# EAGLE design relay-set-d-large-block (EAGLE 7.3.0)
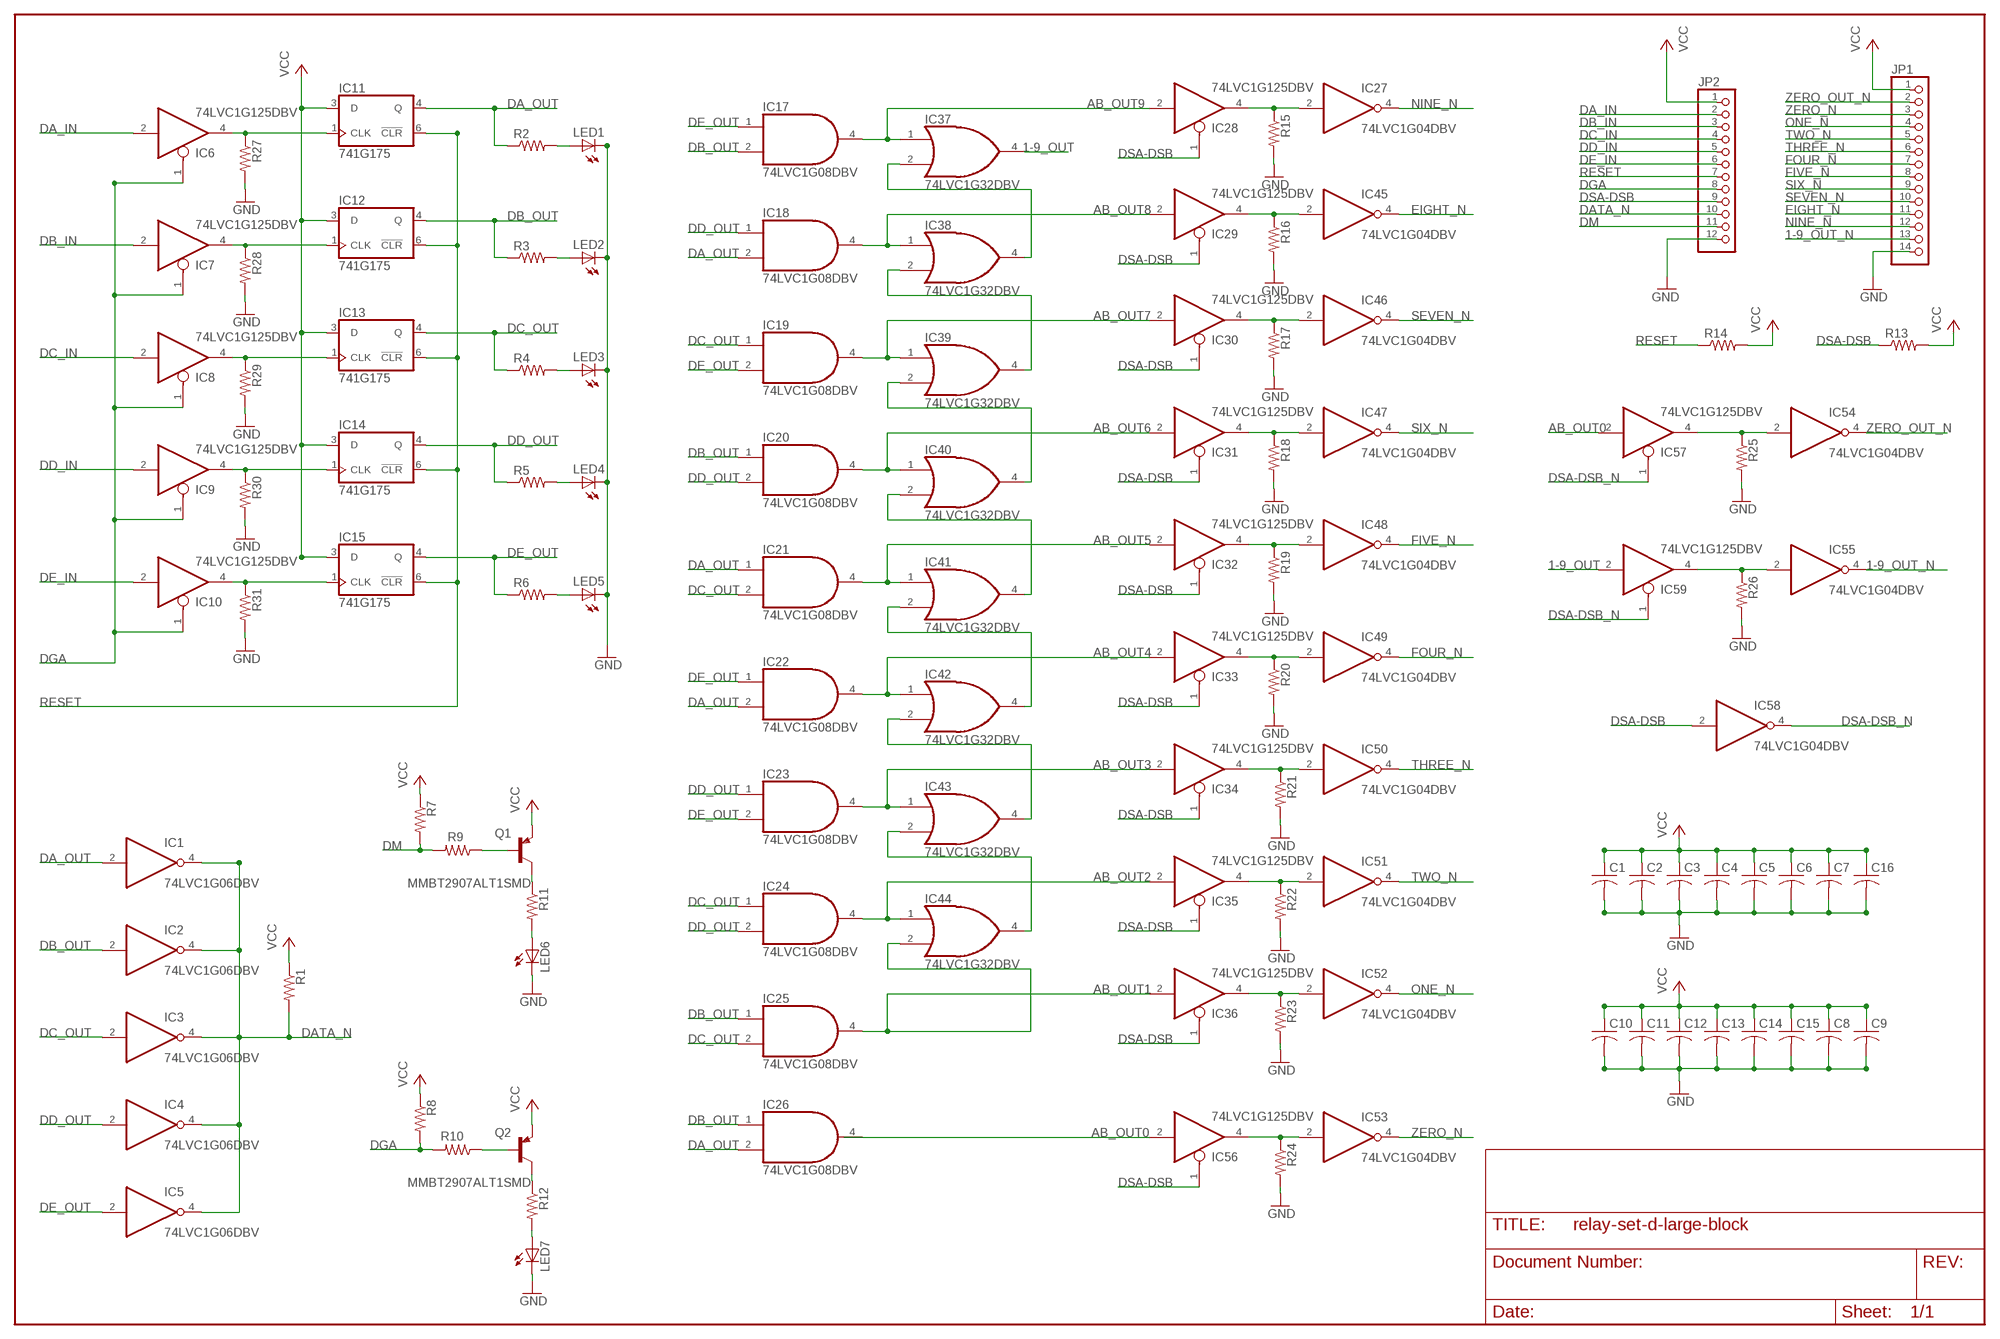
[diagram p0: schematic, sheet 1]

## Parts
C1  C-USC0805  [C0805]
C2  C-USC0805  [C0805]
C3  C-USC0805  [C0805]
C4  C-USC0805  [C0805]
C5  C-USC0805  [C0805]
C6  C-USC0805  [C0805]
C7  C-USC0805  [C0805]
C8  C-USC0805  [C0805]
C9  C-USC0805  [C0805]
C10  C-USC0805  [C0805]
C11  C-USC0805  [C0805]
C12  C-USC0805  [C0805]
C13  C-USC0805  [C0805]
C14  C-USC0805  [C0805]
C15  C-USC0805  [C0805]
C16  C-USC0805  [C0805]
IC1  74LVC1G06DBV  74AUC1G06DBV  [SOT23-5]
IC2  74LVC1G06DBV  74AUC1G06DBV  [SOT23-5]
IC3  74LVC1G06DBV  74AUC1G06DBV  [SOT23-5]
IC4  74LVC1G06DBV  74AUC1G06DBV  [SOT23-5]
IC5  74LVC1G06DBV  74AUC1G06DBV  [SOT23-5]
IC6  74LVC1G125DBV  [SOT23-5]
IC7  74LVC1G125DBV  [SOT23-5]
IC8  74LVC1G125DBV  [SOT23-5]
IC9  74LVC1G125DBV  [SOT23-5]
IC10  74LVC1G125DBV  [SOT23-5]
IC11  741G175  [DBV_R-PDSO-G6]
IC12  741G175  [DBV_R-PDSO-G6]
IC13  741G175  [DBV_R-PDSO-G6]
IC14  741G175  [DBV_R-PDSO-G6]
IC15  741G175  [DBV_R-PDSO-G6]
IC17  74LVC1G08DBV  [SOT23-5]
IC18  74LVC1G08DBV  [SOT23-5]
IC19  74LVC1G08DBV  [SOT23-5]
IC20  74LVC1G08DBV  [SOT23-5]
IC21  74LVC1G08DBV  [SOT23-5]
IC22  74LVC1G08DBV  [SOT23-5]
IC23  74LVC1G08DBV  [SOT23-5]
IC24  74LVC1G08DBV  [SOT23-5]
IC25  74LVC1G08DBV  [SOT23-5]
IC26  74LVC1G08DBV  [SOT23-5]
IC27  74LVC1G04DBV  [SOT23-5]
IC28  74LVC1G125DBV  [SOT23-5]
IC29  74LVC1G125DBV  [SOT23-5]
IC30  74LVC1G125DBV  [SOT23-5]
IC31  74LVC1G125DBV  [SOT23-5]
IC32  74LVC1G125DBV  [SOT23-5]
IC33  74LVC1G125DBV  [SOT23-5]
IC34  74LVC1G125DBV  [SOT23-5]
IC35  74LVC1G125DBV  [SOT23-5]
IC36  74LVC1G125DBV  [SOT23-5]
IC37  74LVC1G32DBV  74AHC1G32DBV  [SOT23-5]
IC38  74LVC1G32DBV  74AHC1G32DBV  [SOT23-5]
IC39  74LVC1G32DBV  74AHC1G32DBV  [SOT23-5]
IC40  74LVC1G32DBV  74AHC1G32DBV  [SOT23-5]
IC41  74LVC1G32DBV  74AHC1G32DBV  [SOT23-5]
IC42  74LVC1G32DBV  74AHC1G32DBV  [SOT23-5]
IC43  74LVC1G32DBV  74AHC1G32DBV  [SOT23-5]
IC44  74LVC1G32DBV  74AHC1G32DBV  [SOT23-5]
IC45  74LVC1G04DBV  [SOT23-5]
IC46  74LVC1G04DBV  [SOT23-5]
IC47  74LVC1G04DBV  [SOT23-5]
IC48  74LVC1G04DBV  [SOT23-5]
IC49  74LVC1G04DBV  [SOT23-5]
IC50  74LVC1G04DBV  [SOT23-5]
IC51  74LVC1G04DBV  [SOT23-5]
IC52  74LVC1G04DBV  [SOT23-5]
IC53  74LVC1G04DBV  [SOT23-5]
IC54  74LVC1G04DBV  [SOT23-5]
IC55  74LVC1G04DBV  [SOT23-5]
IC56  74LVC1G125DBV  [SOT23-5]
IC57  74LVC1G125DBV  [SOT23-5]
IC58  74LVC1G04DBV  [SOT23-5]
IC59  74LVC1G125DBV  [SOT23-5]
JP1  PINHD-1X14  [1X14]
JP2  PINHD-1X12  [1X12]
LED1  LEDCHIP-LED0805  [CHIP-LED0805]
LED2  LEDCHIP-LED0805  [CHIP-LED0805]
LED3  LEDCHIP-LED0805  [CHIP-LED0805]
LED4  LEDCHIP-LED0805  [CHIP-LED0805]
LED5  LEDCHIP-LED0805  [CHIP-LED0805]
LED6  LEDCHIP-LED0805  [CHIP-LED0805]
LED7  LEDCHIP-LED0805  [CHIP-LED0805]
Q1  MMBT2907ALT1SMD  [SOT23-BEC]
Q2  MMBT2907ALT1SMD  [SOT23-BEC]
R1  R-US_R0805  [R0805]
R2  R-US_R0805  [R0805]
R3  R-US_R0805  [R0805]
R4  R-US_R0805  [R0805]
R5  R-US_R0805  [R0805]
R6  R-US_R0805  [R0805]
R7  R-US_R0805  [R0805]
R8  R-US_R0805  [R0805]
R9  R-US_R0805  [R0805]
R10  R-US_R0805  [R0805]
R11  R-US_R0805  [R0805]
R12  R-US_R0805  [R0805]
R13  R-US_R0805  [R0805]
R14  R-US_R0805  [R0805]
R15  R-US_R0805  [R0805]
R16  R-US_R0805  [R0805]
R17  R-US_R0805  [R0805]
R18  R-US_R0805  [R0805]
R19  R-US_R0805  [R0805]
R20  R-US_R0805  [R0805]
R21  R-US_R0805  [R0805]
R22  R-US_R0805  [R0805]
R23  R-US_R0805  [R0805]
R24  R-US_R0805  [R0805]
R25  R-US_R0805  [R0805]
R26  R-US_R0805  [R0805]
R27  R-US_R0805  [R0805]
R28  R-US_R0805  [R0805]
R29  R-US_R0805  [R0805]
R30  R-US_R0805  [R0805]
R31  R-US_R0805  [R0805]

## Nets
1-9_OUT: IC37.4(O) IC59.2(I)
1-9_OUT_N: IC55.4(O) JP1.13
AB_OUT: IC26.4(O)
AB_OUT0: IC56.2(I) IC57.2(I)
AB_OUT1: IC25.4(O) IC36.2(I) IC44.2(I1)
AB_OUT2: IC24.4(O) IC35.2(I) IC44.1(I0)
AB_OUT3: IC23.4(O) IC34.2(I) IC43.1(I0)
AB_OUT4: IC22.4(O) IC33.2(I) IC42.1(I0)
AB_OUT5: IC21.4(O) IC32.2(I) IC41.1(I0)
AB_OUT6: IC20.4(O) IC31.2(I) IC40.1(I0)
AB_OUT7: IC19.4(O) IC30.2(I) IC39.1(I0)
AB_OUT8: IC18.4(O) IC29.2(I) IC38.1(I0)
AB_OUT9: IC17.4(O) IC28.2(I) IC37.1(I0)
DA: IC6.4(O) IC11.1(CLK) R27.1
DA_IN: IC6.2(I) JP2.2
DA_OUT: IC1.2(I) IC11.4(Q) IC18.2(I1) IC21.1(I0) IC22.2(I1) IC26.2(I1) R2.1
DATA_N: IC1.4(O) IC2.4(O) IC3.4(O) IC4.4(O) IC5.4(O) JP2.10 R1.2
DB: IC7.4(O) IC12.1(CLK) R28.1
DB_IN: IC7.2(I) JP2.3
DB_OUT: IC2.2(I) IC12.4(Q) IC17.2(I1) IC20.1(I0) IC25.1(I0) IC26.1(I0) R3.1
DC: IC8.4(O) IC13.1(CLK) R29.1
DC_IN: IC8.2(I) JP2.4
DC_OUT: IC3.2(I) IC13.4(Q) IC19.1(I0) IC21.2(I1) IC24.1(I0) IC25.2(I1) R4.1
DD: IC9.4(O) IC14.1(CLK) R30.1
DD_IN: IC9.2(I) JP2.5
DD_OUT: IC4.2(I) IC14.4(Q) IC18.1(I0) IC20.2(I1) IC23.1(I0) IC24.2(I1) R5.1
DE: IC10.4(O) IC15.1(CLK) R31.1
DE_IN: IC10.2(I) JP2.6
DE_OUT: IC5.2(I) IC15.4(Q) IC17.1(I0) IC19.2(I1) IC22.1(I0) IC23.2(I1) R6.1
DGA: IC6.1(OE) IC7.1(OE) IC8.1(OE) IC9.1(OE) IC10.1(OE) JP2.8 R8.2 R10.2
DM: JP2.11 R7.2 R9.2
DSA-DSB: IC28.1(OE) IC29.1(OE) IC30.1(OE) IC31.1(OE) IC32.1(OE) IC33.1(OE) IC34.1(OE) IC35.1(OE) IC36.1(OE) IC56.1(OE) IC58.2(I) JP2.9 R13.1
DSA-DSB_N: IC57.1(OE) IC58.4(O) IC59.1(OE)
EIGHT: IC29.4(O) IC45.2(I) R16.1
EIGHT_N: IC45.4(O) JP1.11
FIVE: IC32.4(O) IC48.2(I) R19.1
FIVE_N: IC48.4(O) JP1.8
FOUR: IC33.4(O) IC49.2(I) R20.1
FOUR_N: IC49.4(O) JP1.7
GND: C1.2 C2.2 C3.2 C4.2 C5.2 C6.2 C7.2 C8.2 C9.2 C10.2 C11.2 C12.2 C13.2 C14.2 C15.2 C16.2 JP1.14 JP2.12 LED1.C LED2.C LED3.C LED4.C LED5.C LED6.C LED7.C R15.2 R16.2 R17.2 R18.2 R19.2 R20.2 R21.2 R22.2 R23.2 R24.2 R25.2 R26.2 R27.2 R28.2 R29.2 R30.2 R31.2
N$11: IC40.2(I1) IC41.4(O)
N$12: IC41.2(I1) IC42.4(O)
N$13: IC42.2(I1) IC43.4(O)
N$14: IC43.2(I1) IC44.4(O)
N$16: Q2.B R10.1
N$17: IC37.2(I1) IC38.4(O)
N$18: IC38.2(I1) IC39.4(O)
N$19: IC39.2(I1) IC40.4(O)
N$20: LED1.A R2.2
N$21: LED2.A R3.2
N$22: LED3.A R4.2
N$23: Q2.C R12.1
N$24: LED7.A R12.2
N$25: Q1.B R9.1
N$26: Q1.C R11.1
N$27: LED6.A R11.2
N$28: LED4.A R5.2
N$29: LED5.A R6.2
NINE: IC27.2(I) IC28.4(O) R15.1
NINE_N: IC27.4(O) JP1.12
ONE: IC36.4(O) IC52.2(I) R23.1
ONE_N: IC52.4(O) JP1.4
OUT0: IC54.2(I) IC57.4(O) R25.1
OUT1-9: IC55.2(I) IC59.4(O) R26.1
RESET: IC11.6(!CLR) IC12.6(!CLR) IC13.6(!CLR) IC14.6(!CLR) IC15.6(!CLR) JP2.7 R14.1
SEVEN: IC30.4(O) IC46.2(I) R17.1
SEVEN_N: IC46.4(O) JP1.10
SIX: IC31.4(O) IC47.2(I) R18.1
SIX_N: IC47.4(O) JP1.9
THREE: IC34.4(O) IC50.2(I) R21.1
THREE_N: IC50.4(O) JP1.6
TWO: IC35.4(O) IC51.2(I) R22.1
TWO_N: IC51.4(O) JP1.5
VCC: C1.1 C2.1 C3.1 C4.1 C5.1 C6.1 C7.1 C8.1 C9.1 C10.1 C11.1 C12.1 C13.1 C14.1 C15.1 C16.1 IC11.3(D) IC12.3(D) IC13.3(D) IC14.3(D) IC15.3(D) JP1.1 JP2.1 Q1.E Q2.E R1.1 R7.1 R8.1 R13.2 R14.2
ZERO: IC53.2(I) IC56.4(O) R24.1
ZERO_N: IC53.4(O) JP1.3
ZERO_OUT_N: IC54.4(O) JP1.2

## Power pins joined to a net without a drawn wire
GND: IC1.3(GND) IC2.3(GND) IC3.3(GND) IC4.3(GND) IC5.3(GND) IC6.3(GND) IC7.3(GND) IC8.3(GND) IC9.3(GND) IC10.3(GND) IC11.2(GND) IC12.2(GND) IC13.2(GND) IC14.2(GND) IC15.2(GND) IC17.3(GND) IC18.3(GND) IC19.3(GND) IC20.3(GND) IC21.3(GND) IC22.3(GND) IC23.3(GND) IC24.3(GND) IC25.3(GND) IC26.3(GND) IC27.3(GND) IC28.3(GND) IC29.3(GND) IC30.3(GND) IC31.3(GND) IC32.3(GND) IC33.3(GND) IC34.3(GND) IC35.3(GND) IC36.3(GND) IC37.3(GND) IC38.3(GND) IC39.3(GND) IC40.3(GND) IC41.3(GND) IC42.3(GND) IC43.3(GND) IC44.3(GND) IC45.3(GND) IC46.3(GND) IC47.3(GND) IC48.3(GND) IC49.3(GND) IC50.3(GND) IC51.3(GND) IC52.3(GND) IC53.3(GND) IC54.3(GND) IC55.3(GND) IC56.3(GND) IC57.3(GND) IC58.3(GND) IC59.3(GND)
VCC: IC1.5(VCC) IC2.5(VCC) IC3.5(VCC) IC4.5(VCC) IC5.5(VCC) IC6.5(VCC) IC7.5(VCC) IC8.5(VCC) IC9.5(VCC) IC10.5(VCC) IC11.5(VCC) IC12.5(VCC) IC13.5(VCC) IC14.5(VCC) IC15.5(VCC) IC17.5(VCC) IC18.5(VCC) IC19.5(VCC) IC20.5(VCC) IC21.5(VCC) IC22.5(VCC) IC23.5(VCC) IC24.5(VCC) IC25.5(VCC) IC26.5(VCC) IC27.5(VCC) IC28.5(VCC) IC29.5(VCC) IC30.5(VCC) IC31.5(VCC) IC32.5(VCC) IC33.5(VCC) IC34.5(VCC) IC35.5(VCC) IC36.5(VCC) IC37.5(VCC) IC38.5(VCC) IC39.5(VCC) IC40.5(VCC) IC41.5(VCC) IC42.5(VCC) IC43.5(VCC) IC44.5(VCC) IC45.5(VCC) IC46.5(VCC) IC47.5(VCC) IC48.5(VCC) IC49.5(VCC) IC50.5(VCC) IC51.5(VCC) IC52.5(VCC) IC53.5(VCC) IC54.5(VCC) IC55.5(VCC) IC56.5(VCC) IC57.5(VCC) IC58.5(VCC) IC59.5(VCC)

## Library data of the parts
C1-C16 = resistor:C-US: CAPACITOR, American symbol
IC1-IC5 = 74xx-little-us:74*1G06: Single Inverter Buffer/Driver With Open-Drain Output
IC6-IC10 IC28-IC36 IC56 IC57 IC59 = 74xx-little-us:74*1G125: Single Bus Buffer Gate with 3-State Output
IC11-IC15 = 74xx-little-us:74*1G175
IC17-IC26 = 74xx-little-us:74*1G08: 2-input AND gate
IC27 IC45-IC55 IC58 = 74xx-little-us:74*1G04: INVERTER Gate
IC37-IC44 = 74xx-little-us:74*1G32: 2-input OR gate
JP1 = pinhead:PINHD-1X14: PIN HEADER
JP2 = pinhead:PINHD-1X12: PIN HEADER
LED1-LED7 = led:LED: LED OSRAM: - CHIPLED LG R971, LG N971, LY N971, LG Q971, LY Q971, LO R971, LY R971 LH N974, LH R974 LS Q976, LO Q976, LY Q976 LO Q996 - Hyper CHIPLED LW Q18S LB Q993, LB Q99A, LB R99A - SideLED LS A670, LO A670, LY A670, LG A670, LP A670 LB A673, LV A673, LT A673, LW A673 LH A674 LY A675 LS A676, LA A676, LO A676, LY A676, LW A676 LS A679, LY A679, LG A679 - Hyper Micro SIDELED® LS Y876, LA Y876, LO Y876, LY Y876 LT Y87S - SmartLED LW L88C, LW L88S LB L89C, LB L89S, LG L890 LS L89K, LO L89K, LY L89K LS L896, LA L896, LO L896, LY L896 - TOPLED LS T670, LO T670, LY T670, LG T670, LP T670 LSG T670, LSP T670, LSY T670, LOP T670, LYG T670 LG T671, LOG T671, LSG T671 LB T673, LV T673, LT T673, LW T673 LH T674 LS T676, LA T676, LO T676, LY T676, LB T676, LH T676, LSB T676, LW T676 LB T67C, LV T67C, LT T67C, LS T67K, LO T67K, LY T67K, LW E67C LS E67B, LA E67B, LO E67B, LY E67B, LB E67C, LV E67C, LT E67C LW T67C LS T679, LY T679, LG T679 LS T770, LO T770, LY T770, LG T770, LP T770 LB T773, LV T773, LT T773, LW T773 LH T774 LS E675, LA E675, LY E675, LS T675 LS T776, LA T776, LO T776, LY T776, LB T776 LHGB T686 LT T68C, LB T68C - Hyper Mini TOPLED® LB M676 - Mini TOPLED Santana® LG M470 LS M47K, LO M47K, LY M47K Source: http://www.osram.convergy.de LUXEON: - LUMILED® LXK2-PW12-R00, LXK2-PW12-S00, LXK2-PW14-U00, LXK2-PW14-V00 LXK2-PM12-R00, LXK2-PM12-S00, LXK2-PM14-U00 LXK2-PE12-Q00, LXK2-PE12-R00, LXK2-PE12-S00, LXK2-PE14-T00, LXK2-PE14-U00 LXK2-PB12-K00, LXK2-PB12-L00, LXK2-PB12-M00, LXK2-PB14-N00, LXK2-PB14-P00, LXK2-PB14-Q00 LXK2-PR12-L00, LXK2-PR12-M00, LXK2-PR14-Q00, LXK2-PR14-R00 LXK2-PD12-Q00, LXK2-PD12-R00, LXK2-PD12-S00 LXK2-PH12-R00, LXK2-PH12-S00 LXK2-PL12-P00, LXK2-PL12-Q00, LXK2-PL12-R00 Source: www.luxeon.com KINGBRIGHT: KA-3528ASYC Source: www.kingbright.com
Q1 Q2 = transistor-pnp:MMBT2907*: PNP Transistror
R1-R31 = resistor:R-US_: RESISTOR, American symbol

## Board
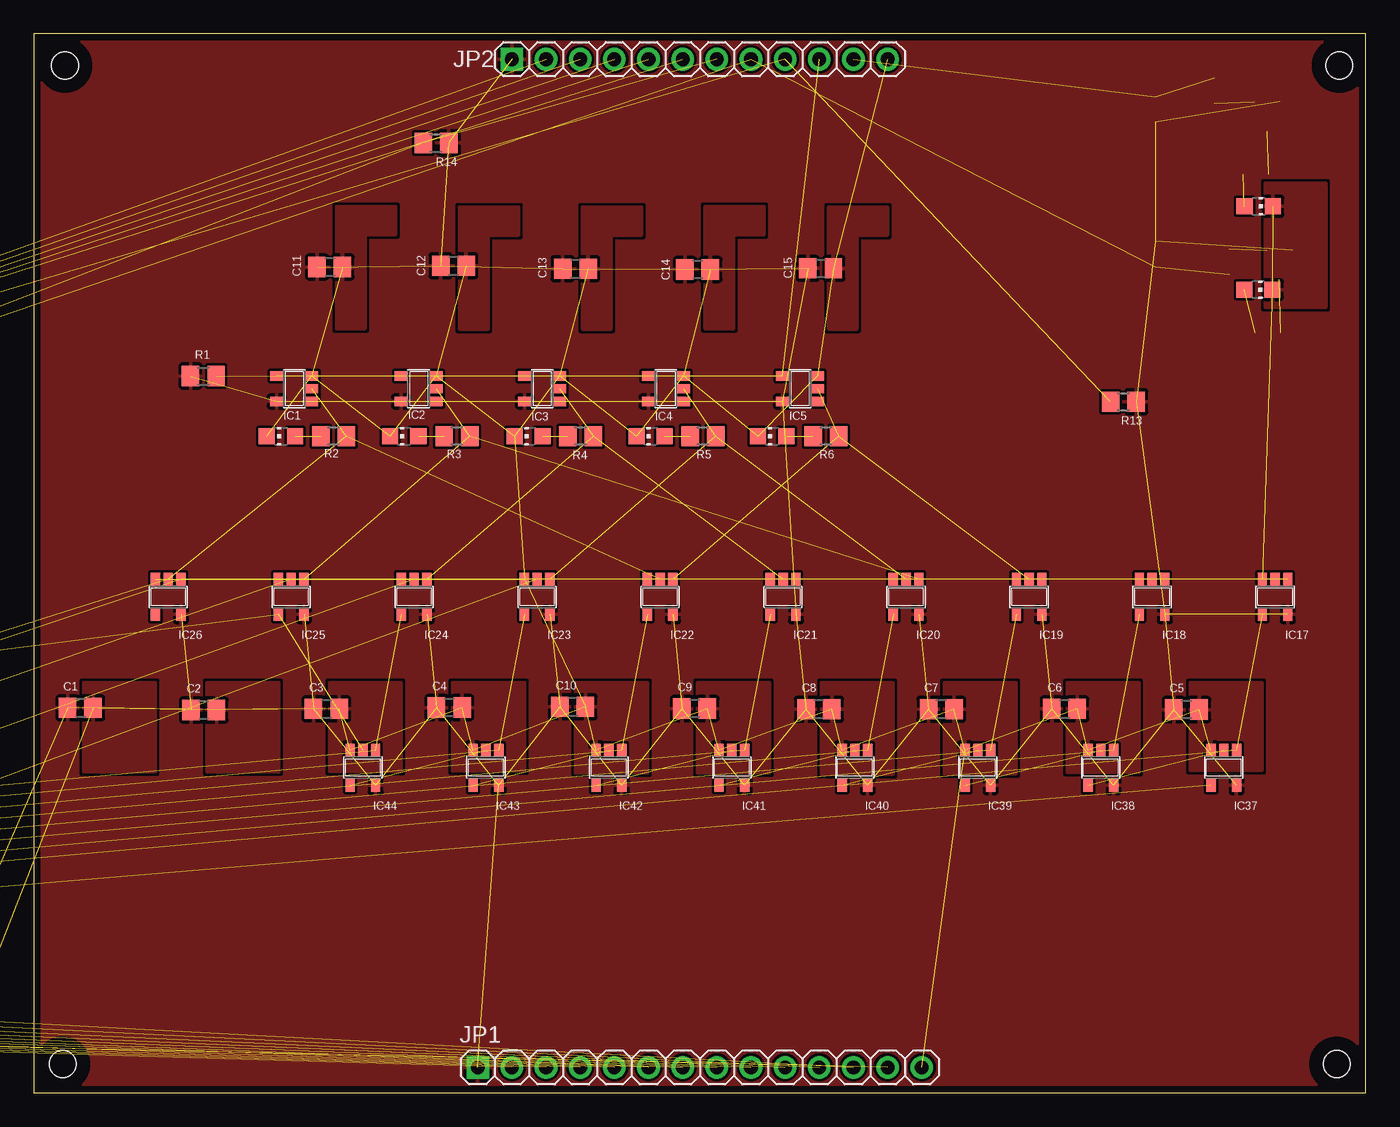
[diagram p1: board, top side]
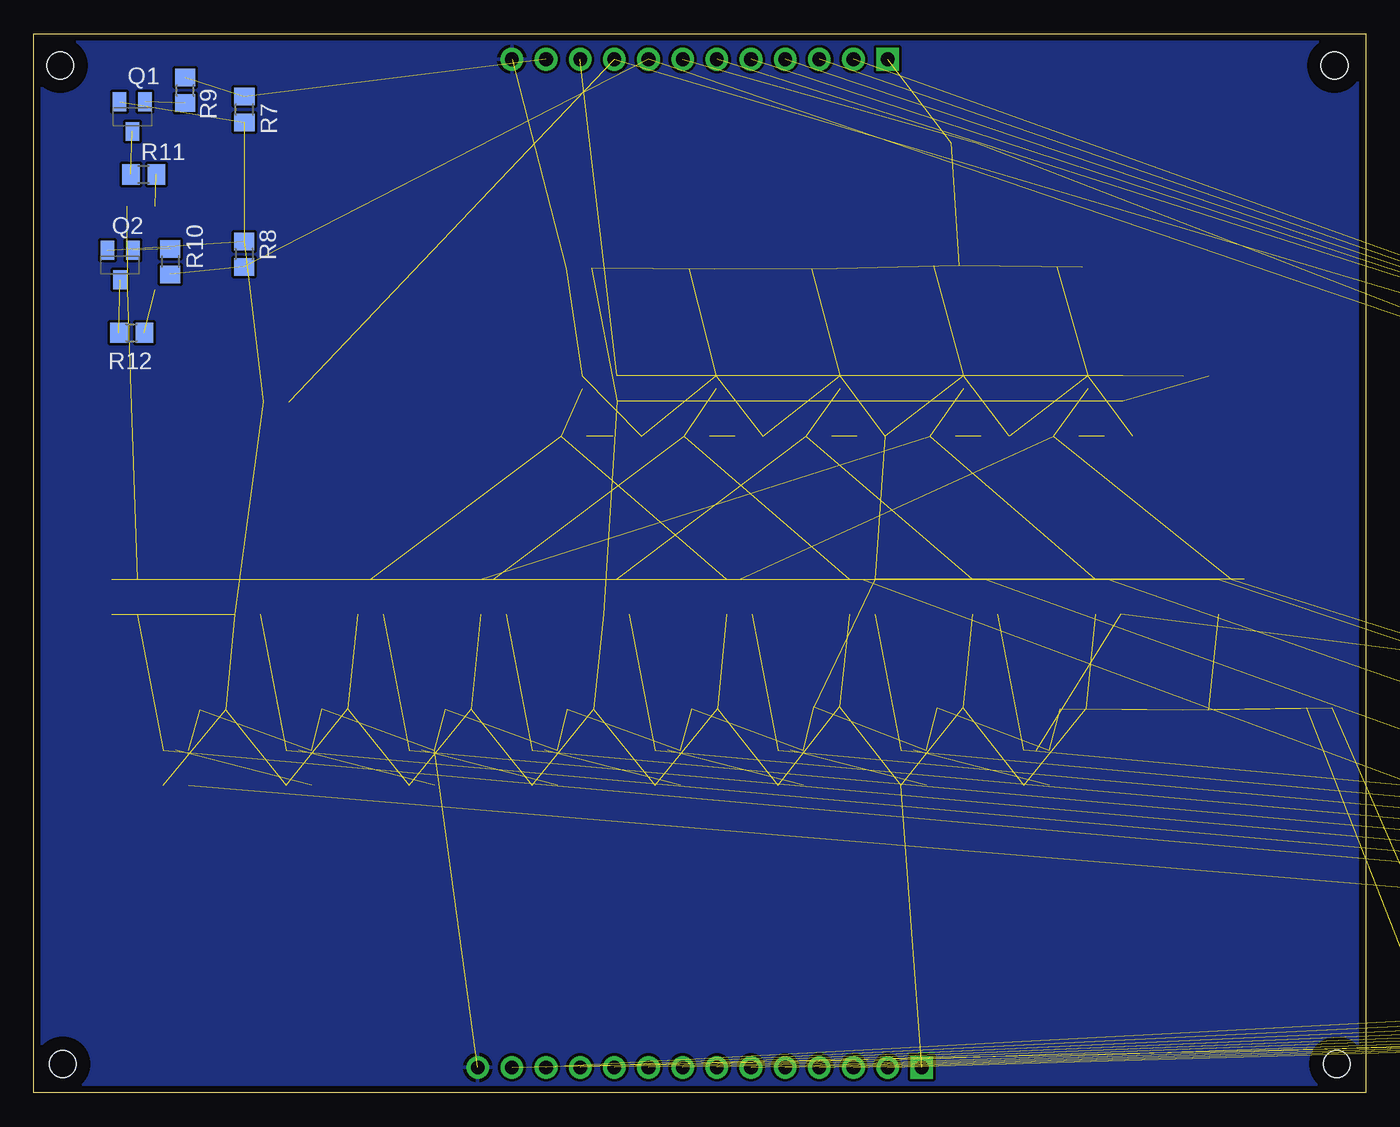
[diagram p2: board, bottom side, seen from below]

Size 99.06 x 78.74 mm. Coordinates in mm from the lower left corner, seen from the top.
Outline: 99.06,78.74 0,78.74 0,0 99.06,0 99.06,78.74
Copper layers (1*16): Top 0.035mm / dielectric 1.5mm / Bottom 0.035mm
Design rules "default *": minimum track width 8mil, minimum drill 12mil, track to track 8mil, track to pad 10mil, pad to pad 10mil, via to via 8mil, smd to smd 8mil, copper to edge 20mil, drill to drill 8mil, minimum pad ring 10mil, minimum via ring 8mil, stop-mask expansion 4mil, vias tented up to drill 0mil, thermal gap 10mil
Holes 2.01 mm at 2.16,2.16 96.9,2.16 97.08,76.38 2.34,76.38
tRestrict: area 94.9,0.2 to 98.9,4.2; area 95.1,74.4 to 99.1,78.4; area 0.3,74.4 to 4.3,78.4; area 0.2,0.2 to 4.2,4.2
bRestrict: area 94.9,0.2 to 98.9,4.2; area 95.1,74.4 to 99.1,78.4; area 0.3,74.4 to 4.3,78.4; area 0.2,0.2 to 4.2,4.2

### Footprints (pad centres in the part's own frame; a part is rotated, then mirrored left to right if it is on the bottom)
C0805 = smd 1.3 x 1.5: 1 -0.95,0; 2 0.95,0
SOT23-5 = smd 0.69 x 0.99: 1 -0.95,-1.29; 2 0,-1.29; 3 0.95,-1.29; 4 0.95,1.3; 5 -0.95,1.3
DBV_R-PDSO-G6 = smd 0.69 x 0.99: 1 -0.95,-1.29; 2 0,-1.29; 3 0.95,-1.29; 4 0.95,1.3; 5 0,1.3; 6 -0.95,1.3
1X14 = drill 1.016 pad 1.676 square: 1 -16.51,0 | drill 1.016 pad 1.676: 2 -13.97,0; 3 -11.43,0; 4 -8.89,0; 5 -6.35,0; 6 -3.81,0; 7 -1.27,0; 8 1.27,0; 9 3.81,0; 10 6.35,0; 11 8.89,0; 12 11.43,0; 13 13.97,0; 14 16.51,0
1X12 = drill 1.016 pad 1.676 square: 1 -13.97,0 | drill 1.016 pad 1.676: 2 -11.43,0; 3 -8.89,0; 4 -6.35,0; 5 -3.81,0; 6 -1.27,0; 7 1.27,0; 8 3.81,0; 9 6.35,0; 10 8.89,0; 11 11.43,0; 12 13.97,0
CHIP-LED0805 = smd 1.2 x 1.2: A 0,-1.05; C 0,1.05
SOT23-BEC = smd 1 x 1.4: B -0.95,-1.1; C 0,1.1; E 0.95,-1.1
R0805 = smd 1.3 x 1.5: 1 -0.95,0; 2 0.95,0

### Placement (x,y rotation side)
C1  3.48,28.63 0 top
C2  12.65,28.47 0 top
C3  21.77,28.55 0 top
C4  30.91,28.65 0 top
C5  85.72,28.5 0 top
C6  76.66,28.55 0 top
C7  67.49,28.52 0 top
C8  58.39,28.52 0 top
C9  49.15,28.57 0 top
C10  40.08,28.7 0 top
C11  22.02,61.39 0 top
C12  31.22,61.49 0 top
C13  40.28,61.26 0 top
C14  49.38,61.21 0 top
C15  58.52,61.29 0 top
C16  -334.62,-107.34 0 top  (outside the outline)
IC1  19.38,52.35 90 top
IC2  28.63,52.35 90 top
IC3  37.82,52.35 90 top
IC4  47.02,52.35 90 top
IC5  57,52.35 90 top
IC6  -301.68,-43.66 0 top  (outside the outline)
IC7  -309.65,-43.66 0 top  (outside the outline)
IC8  -317.63,-43.66 0 top  (outside the outline)
IC9  -325.6,-43.66 0 top  (outside the outline)
IC10  -333.58,-43.66 0 top  (outside the outline)
IC11  -334.21,-71.53 0 top  (outside the outline)
IC12  -334.21,-78.82 0 top  (outside the outline)
IC13  -334.21,-86.11 0 top  (outside the outline)
IC14  -334.21,-93.4 0 top  (outside the outline)
IC15  -334.21,-100.69 0 top  (outside the outline)
IC17  92.3,36.88 180 top
IC18  83.16,36.88 180 top
IC19  74.02,36.88 180 top
IC20  64.87,36.88 180 top
IC21  55.73,36.88 180 top
IC22  46.58,36.88 180 top
IC23  37.44,36.88 180 top
IC24  28.3,36.88 180 top
IC25  19.15,36.88 180 top
IC26  10.01,36.88 180 top
IC27  -6.58,4.19 0 top  (outside the outline)
IC28  -205.97,0.2 0 top  (outside the outline)
IC29  -213.94,0.2 0 top  (outside the outline)
IC30  -221.92,0.2 0 top  (outside the outline)
IC31  -229.9,0.2 0 top  (outside the outline)
IC32  -237.87,0.2 0 top  (outside the outline)
IC33  -245.85,0.2 0 top  (outside the outline)
IC34  -253.82,0.2 0 top  (outside the outline)
IC35  -261.8,0.2 0 top  (outside the outline)
IC36  -269.77,0.2 0 top  (outside the outline)
IC37  88.49,24.18 180 top
IC38  79.35,24.18 180 top
IC39  70.21,24.18 180 top
IC40  61.06,24.18 180 top
IC41  51.92,24.18 180 top
IC42  42.77,24.18 180 top
IC43  33.63,24.18 180 top
IC44  24.49,24.18 180 top
IC45  -14.55,4.19 0 top  (outside the outline)
IC46  -22.53,4.19 0 top  (outside the outline)
IC47  -30.51,4.19 0 top  (outside the outline)
IC48  -38.48,4.19 0 top  (outside the outline)
IC49  -46.46,4.19 0 top  (outside the outline)
IC50  -54.43,4.19 0 top  (outside the outline)
IC51  -62.41,4.19 0 top  (outside the outline)
IC52  -70.38,4.19 0 top  (outside the outline)
IC53  -78.36,4.19 0 top  (outside the outline)
IC54  -86.33,4.19 0 top  (outside the outline)
IC55  -94.31,4.19 0 top  (outside the outline)
IC56  -277.75,0.2 0 top  (outside the outline)
IC57  -285.72,-35.69 0 top  (outside the outline)
IC58  -293.7,-43.66 0 top  (outside the outline)
IC59  -197.99,0.2 0 top  (outside the outline)
JP1  49.53,1.91 0 top
JP2  49.53,76.83 0 top
LED1  18.39,48.82 90 top
LED2  27.56,48.82 90 top
LED3  36.8,48.82 90 top
LED4  45.87,48.82 90 top
LED5  54.91,48.82 90 top
LED6  91.08,65.91 270 top
LED7  91.06,59.72 270 top
Q1  91.72,72.57 180 bottom
Q2  92.63,61.54 180 bottom
R1  12.62,53.29 0 top
R2  22.3,48.82 180 top
R3  31.47,48.82 180 top
R4  40.67,48.82 180 top
R5  49.76,48.82 180 top
R6  58.9,48.82 180 top
R7  83.39,73.1 90 bottom
R8  83.41,62.36 270 bottom
R9  87.78,74.52 90 bottom
R10  88.9,61.8 270 bottom
R11  90.88,68.28 0 bottom
R12  91.77,56.52 0 bottom
R13  81.03,51.38 0 top
R14  29.92,70.61 0 top
R15  -175.11,-3.1 0 top  (outside the outline)
R16  -278.79,-7.09 0 top  (outside the outline)
R17  -278.79,-11.07 0 top  (outside the outline)
R18  -278.79,-15.06 0 top  (outside the outline)
R19  -278.79,-19.05 0 top  (outside the outline)
R20  -278.79,-23.04 0 top  (outside the outline)
R21  -278.79,-27.03 0 top  (outside the outline)
R22  -278.79,-31.01 0 top  (outside the outline)
R23  -278.79,-35 0 top  (outside the outline)
R24  -278.79,-38.99 0 top  (outside the outline)
R25  -286.77,-42.98 0 top  (outside the outline)
R26  -286.77,-46.96 0 top  (outside the outline)
R27  -334.62,-50.95 0 top  (outside the outline)
R28  -334.62,-54.94 0 top  (outside the outline)
R29  -334.62,-58.93 0 top  (outside the outline)
R30  -334.62,-62.92 0 top  (outside the outline)
R31  -334.62,-66.9 0 top  (outside the outline)

### Tracks (layer width: path | path; a pad name or v marks a point on that pad's centre or on a via)
1-9_OUT  (1 unrouted)
1-9_OUT_N  (1 unrouted)
AB_OUT0  (1 unrouted)
AB_OUT1  (2 unrouted)
AB_OUT2  (2 unrouted)
AB_OUT3  (2 unrouted)
AB_OUT4  (2 unrouted)
AB_OUT5  (2 unrouted)
AB_OUT6  (2 unrouted)
AB_OUT7  (2 unrouted)
AB_OUT8  (2 unrouted)
AB_OUT9  (2 unrouted)
DA  (2 unrouted)
DA_IN  (1 unrouted)
DA_OUT  (6 unrouted)
DATA_N  (6 unrouted)
DB  (2 unrouted)
DB_IN  (1 unrouted)
DB_OUT  (6 unrouted)
DC  (2 unrouted)
DC_IN  (1 unrouted)
DC_OUT  (6 unrouted)
DD  (2 unrouted)
DD_IN  (1 unrouted)
DD_OUT  (6 unrouted)
DE  (2 unrouted)
DE_IN  (1 unrouted)
DE_OUT  (6 unrouted)
DGA  (7 unrouted)
DM  (2 unrouted)
DSA-DSB  (12 unrouted)
DSA-DSB_N  (2 unrouted)
EIGHT  (2 unrouted)
EIGHT_N  (1 unrouted)
FIVE  (2 unrouted)
FIVE_N  (1 unrouted)
FOUR  (2 unrouted)
FOUR_N  (1 unrouted)
GND  (99 unrouted)
  pour Bottom: 99.06,0 0,0 0,78.74 99.06,78.74
  pour Top: 3.71,30.48 9.04,30.48 9.04,23.88 3.71,23.88
  pour Top: 12.9,30.48 18.24,30.48 18.24,23.88 12.9,23.88
  pour Top: 22,30.48 27.33,30.48 27.33,23.93 22,23.93
  pour Top: 31.17,30.48 36.5,30.48 36.5,23.95 31.17,23.95
  pour Top: 40.31,30.48 45.64,30.48 45.64,23.8 40.31,23.8
  pour Top: 49.38,30.48 54.71,30.48 54.71,23.8 49.38,23.8
  pour Top: 58.57,30.48 63.91,30.48 63.91,23.7 58.57,23.7
  pour Top: 67.72,30.48 73.05,30.48 73.05,23.72 67.72,23.72
  pour Top: 76.86,30.48 82.19,30.48 82.19,23.85 76.86,23.85
  pour Top: 86,30.48 91.34,30.48 91.34,24 86,24
  pour Top: 24.64,56.85 24.64,63.83 26.9,63.83 26.9,65.84 22.53,65.84 22.53,56.85
  pour Top: 33.78,56.82 33.78,63.8 36.04,63.8 36.04,65.81 31.67,65.81 31.67,56.82
  pour Top: 42.93,56.82 42.93,63.8 45.19,63.8 45.19,65.81 40.82,65.81 40.82,56.82
  pour Top: 52.04,56.85 52.04,63.83 54.31,63.83 54.31,65.84 49.94,65.84 49.94,56.85
  pour Top: 61.21,56.82 61.21,63.8 63.47,63.8 63.47,65.81 59.11,65.81 59.11,56.82
  pour Top: 91.57,67.61 96.09,67.61 96.09,58.39 91.57,58.39
N$11  (1 unrouted)
N$12  (1 unrouted)
N$13  (1 unrouted)
N$14  (1 unrouted)
N$16  (1 unrouted)
N$17  (1 unrouted)
N$18  (1 unrouted)
N$19  (1 unrouted)
N$20  (1 unrouted)
N$21  (1 unrouted)
N$22  (1 unrouted)
N$23  (1 unrouted)
N$24  (1 unrouted)
N$25  (1 unrouted)
N$26  (1 unrouted)
N$27  (1 unrouted)
N$28  (1 unrouted)
N$29  (1 unrouted)
NINE  (2 unrouted)
NINE_N  (1 unrouted)
ONE  (2 unrouted)
ONE_N  (1 unrouted)
OUT0  (2 unrouted)
OUT1-9  (2 unrouted)
RESET  (6 unrouted)
SEVEN  (2 unrouted)
SEVEN_N  (1 unrouted)
SIX  (2 unrouted)
SIX_N  (1 unrouted)
THREE  (2 unrouted)
THREE_N  (1 unrouted)
TWO  (2 unrouted)
TWO_N  (1 unrouted)
VCC  (87 unrouted)
  pour Top (rank 2): 99.06,0 0,0 0,78.74 99.06,78.74
ZERO  (2 unrouted)
ZERO_N  (1 unrouted)
ZERO_OUT_N  (1 unrouted)

### Text on the board
Document: Relay Set D | OUTPUT | INPUT | A | B | C | D | E